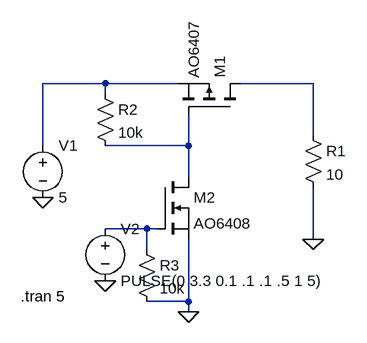
[diagram p0: schematic power_enable.asc]
power_enable.asc, the LTspice schematic file:
Version 4
SHEET 1 880 680
WIRE 160 32 64 32
WIRE 272 32 160 32
WIRE 480 32 368 32
WIRE 160 48 160 32
WIRE 480 112 480 32
WIRE 64 128 64 32
WIRE 288 128 288 80
WIRE 288 128 160 128
WIRE 288 176 288 128
WIRE 224 256 160 256
WIRE 240 256 224 256
WIRE 480 272 480 192
WIRE 224 288 224 256
WIRE 288 368 288 272
WIRE 288 368 224 368
WIRE 288 384 288 368
FLAG 64 208 0
FLAG 480 272 0
FLAG 160 336 0
FLAG 288 384 0
SYMBOL voltage 64 112 R0
WINDOW 123 0 0 Left 0
WINDOW 39 0 0 Left 0
SYMATTR InstName V1
SYMATTR Value 5
SYMBOL pmos 368 80 M270
SYMATTR InstName M1
SYMATTR Value AO6407
SYMBOL nmos 240 176 R0
SYMATTR InstName M2
SYMATTR Value AO6408
SYMBOL res 464 96 R0
SYMATTR InstName R1
SYMATTR Value 10
SYMBOL res 144 32 R0
SYMATTR InstName R2
SYMATTR Value 10k
SYMBOL voltage 160 240 R0
WINDOW 123 0 0 Left 0
WINDOW 39 0 0 Left 0
SYMATTR InstName V2
SYMATTR Value PULSE(0 3.3 0.1 .1 .1 .5 1 5)
SYMBOL res 208 272 R0
SYMATTR InstName R3
SYMATTR Value 10k
TEXT 30 360 Left 2 !.tran 5

The netlist it stands for:
* power_enable.asc
V1 N001 0 5
M1 N002 N003 N001 N001 AO6407
M2 N003 N004 0 0 AO6408
R1 N002 0 10
R2 N001 N003 10k
V2 N004 0 PULSE(0 3.3 0.1 .1 .1 .5 1 5)
R3 N004 0 10k
.model NMOS NMOS
.model PMOS PMOS
.lib standard.mos
.tran 5
.backanno
.end